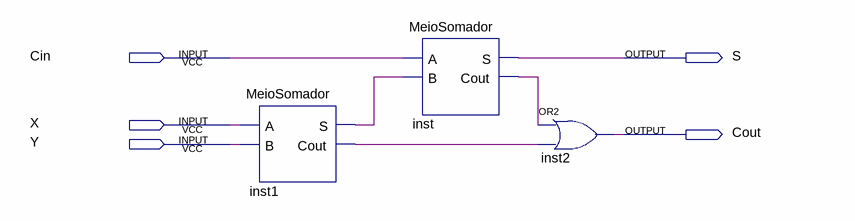
[diagram p0: schematic sheet]
// Quartus schematic SomadorCompleto.bdf as structural Verilog: 3 symbols, 5 pins
module SomadorCompleto (
  input  Cin,
  input  X,
  input  Y,
  output S,
  output Cout
);

  wire inst1_cout, inst1_s, inst_cout;

  MeioSomador inst1 (.A(X), .B(Y), .S(inst1_s), .Cout(inst1_cout));
  MeioSomador inst (.A(Cin), .B(inst1_s), .S(S), .Cout(inst_cout));
  or inst2 (Cout, inst_cout, inst1_cout);
endmodule
